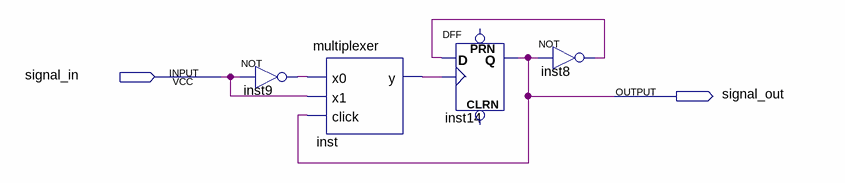
[diagram p0: schematic sheet]
// Quartus schematic delay.bdf as structural Verilog: 4 symbols, 2 pins
module delay (
  input  signal_in,
  output signal_out
);

  wire inst8_out, inst9_out, inst_y;

  not inst9 (inst9_out, signal_in);
  multiplexer inst (.x0(inst9_out), .x1(signal_in), .click(signal_out), .y(inst_y));
  DFF inst14 (.CLK(inst_y), .D(inst8_out), .Q(signal_out));  // open: CLRN, PRN
  not inst8 (inst8_out, signal_out);
endmodule
